# Altium schematic sheet 4~20ma.SchDoc
size A3
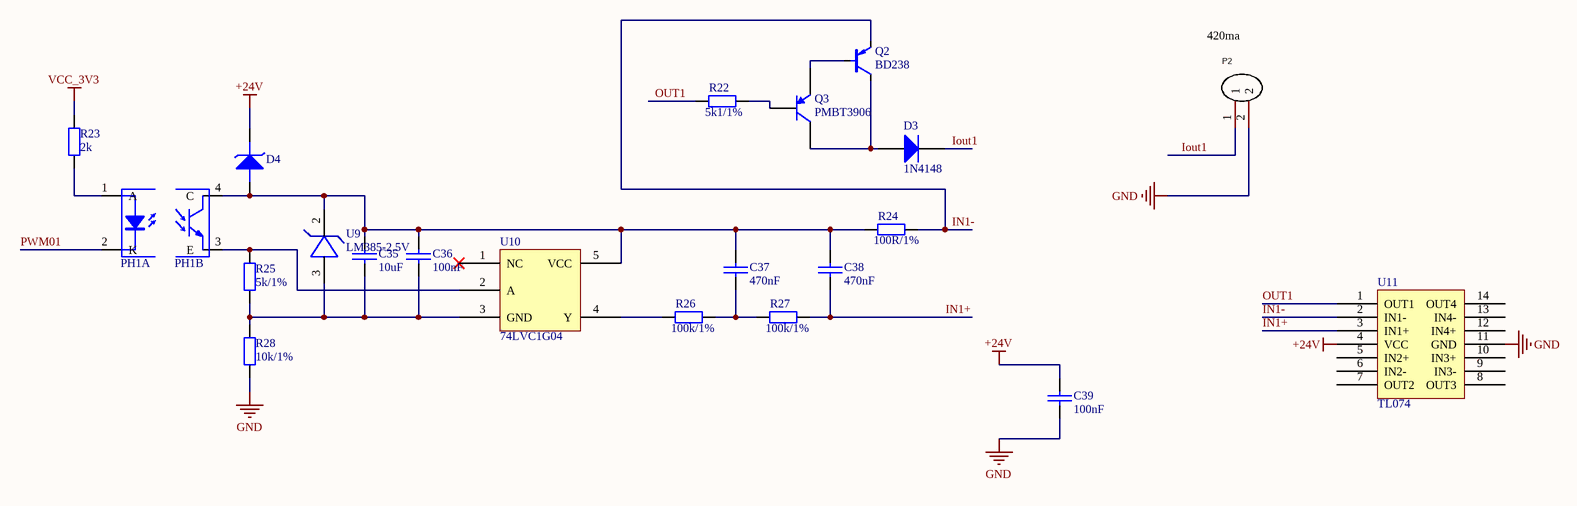
[diagram p0: 4~20ma.SchDoc]

## Parts
C35  10uF  [C-0805]
C36  100nF  [C-0805]
C37  470nF  [C-0805]
C38  470nF  [C-0805]
C39  100nF  [C-0805]
D3  1N4148  [LL-34]
D4  1N4732  [DO-214AC]  (value not drawn)
P2  WJ500V-5.08-2P  [KF128-2P DG128]  (value not drawn)
PH1  PCA817  [SMD-4_L6.5-W4.6-P2.54-LS10.3-TL]  (value not drawn)  (parts A,B of 2)
Q2  BD238  [TO-126]
Q3  PMBT3906  [SOT-23-3]
R22  5k1/1%  [R-0805]
R23  2k  [R-0805]
R24  100R/1%  [R-0805]
R25  5k/1%  [R-0805]
R26  100k/1%  [R-0805]
R27  100k/1%  [R-0805]
R28  10k/1%  [R-0805]
U9  LM385-2.5V  [TO-92]
U10  74LVC1G04  [SOT-23-5]
U11  TL074  [SO-14]

## Nets
+24V: C39.2 D4.2(K) U11.4(VCC)
GND: C39.1 P2.2 R28.2 U11.11(GND)
VCC_3V3: R23.1
IN1+: C38.1 R27.1 U11.3(IN1+)
IN1-: Q2.1(e) R24.1 U11.2(IN1-)
Iout1: D3.2(K) P2.1
OUT1: R22.2 U11.1(OUT1)
PWM01: PH1.2(K)
NetC35_1: C35.1 C36.2 C37.2 C38.2 D4.1(A) PH1.4(C) R24.2 U9.2(C) U10.5(VCC)
NetC35_2: C35.2 C36.1 R25.2 R28.1 U9.3(A) U10.3(GND)
NetC37_1: C37.1 R26.1 R27.2
NetD3_1: D3.1(A) Q2.2(c) Q3.3(C)
NetPH1_1: PH1.1(A) R23.2
NetPH1_3: PH1.3(E) R25.1 U10.2(A)
NetQ2_3: Q2.3(b) Q3.2(E)
NetQ3_1: Q3.1(B) R22.1
NetR26_2: R26.2 U10.4(Y)

Not connected (* = marked no-connect by the designer): U10 1(NC)*; U11 5(IN2+) 6(IN2-) 7(OUT2) 8(OUT3) 9(IN3-) 10(IN3+) 12(IN4+) 13(IN4-) 14(OUT4)

## Notes on the sheet
- (near P2) 420ma

## Library data of the parts
C35-C39 = C普通电容: 电容
D3 = D二极管: 1 Amp General Purpose Rectifier; Published: 8-Jun-2000; LatestRevisionDate: 17-Jul-2002; LatestRevisionNote: Re-released for DXP Platform.; DatasheetVersion: 1998; PackageVersion: Aug-1999; PackageReference: DO-41; Publisher: Altium Limited; Code_JEDEC: DO-204-AL; ComponentLink1Description: Manufacturer Link; ComponentLink1URL: http://www.fairchildsemi.com/; ComponentLink2Description: Datasheet; ComponentLink2URL: http://www.fairchildsemi.com/ds/1N%2F1N4001.pdf
D4 = D稳压二极管: 稳压二极管
P2 = WJ500V-5.08-2P: Manufacturer: KANGNEX(康奈克斯电气); Symbol: WJ500V-5.08-2P-14-00A; Add into BOM: yes; Pitch: 5.08mm; Structure: 1x2P; Number of PINs Per Row: 2; Current Rating (Max): 18A; Voltage Rating (Max): 250V; Wire Gauge - AWG: 14~30; Wire Gauge - mm2: 2.5; Name: WJ500V-5.08-2P; Device: WJ500V-5.08-2P; LCSC Part Name: 5.08mm 1x2P 排数:1 每排P数:2 直针 可拼接; Supplier Part: C8465; Manufacturer Part: WJ500V-5.08-2P; Supplier Footprint: 插件,P=5.08mm; JLCPCB Part Class: Extended Part; Datasheet: https://atta.szlcsc.com/upload/public/pdf/source/20191225/C8465_02D34CE5B5B4A53DF5891601D97FA9F4.pdf; Supplier: LCSC; Convert to PCB: yes; Number of Rows: 1; Mounting Style: 直针; Operating Temperature Range: -40℃~+105℃; Color: 绿色
PH1 = PHOTOCOUPL SEP
Q2 = PNP: 三极管
Q3 = PNP
R22-R28 = RES: 电阻; Value: 5.1K; Published: 8-Jun-2000; LatestRevisionDate: 17-Jul-2002; LatestRevisionNote: Re-released for DXP Platform.; PackageReference: AXIAL-0.4; Publisher: Altium Limited
U9 = LM358-2.5V